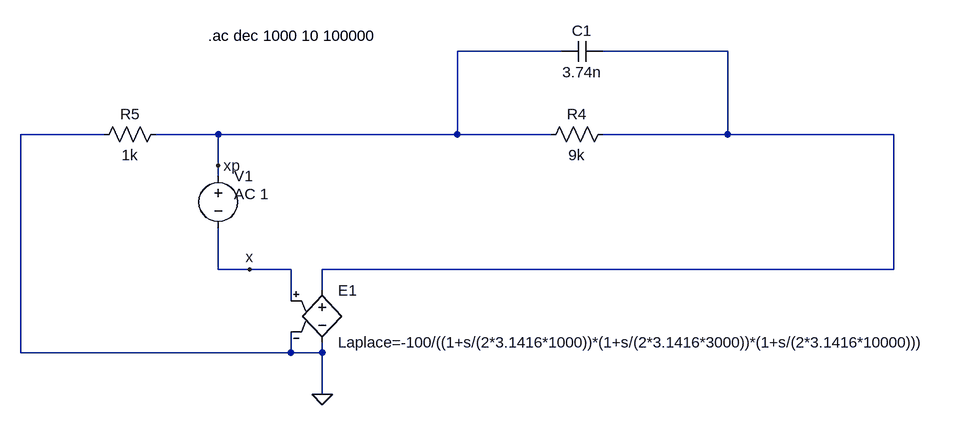
[diagram p0: schematic ganacia de lazo2.asc]
ganacia de lazo2.asc, the LTspice schematic file:
Version 4
SHEET 1 924 680
WIRE -208 -416 -368 -416
WIRE 48 -416 -144 -416
WIRE -912 -288 -1040 -288
WIRE -736 -288 -832 -288
WIRE -368 -288 -368 -416
WIRE -368 -288 -736 -288
WIRE -224 -288 -368 -288
WIRE 48 -288 48 -416
WIRE 48 -288 -144 -288
WIRE 304 -288 48 -288
WIRE -736 -240 -736 -288
WIRE -736 -224 -736 -240
WIRE -736 -80 -736 -144
WIRE -688 -80 -736 -80
WIRE -624 -80 -688 -80
WIRE 304 -80 304 -288
WIRE 304 -80 -576 -80
WIRE -576 -48 -576 -80
WIRE -624 -32 -624 -80
WIRE -1040 48 -1040 -288
WIRE -624 48 -624 16
WIRE -624 48 -1040 48
WIRE -576 48 -576 32
WIRE -576 48 -624 48
WIRE -576 112 -576 48
FLAG -736 -240 xp
FLAG -688 -80 x
FLAG -576 112 0
SYMBOL e -576 -64 R0
SYMATTR InstName E1
SYMATTR Value Laplace=-100/((1+s/(2*3.1416*1000))*(1+s/(2*3.1416*3000))*(1+s/(2*3.1416*10000)))
SYMBOL res -128 -304 R90
WINDOW 0 0 56 VBottom 2
WINDOW 3 32 56 VTop 2
SYMATTR InstName R4
SYMATTR Value 9k
SYMBOL res -816 -304 R90
WINDOW 0 0 56 VBottom 2
WINDOW 3 32 56 VTop 2
SYMATTR InstName R5
SYMATTR Value 1k
SYMBOL voltage -736 -240 R0
WINDOW 123 24 44 Left 2
WINDOW 39 0 0 Left 2
SYMATTR Value2 AC 1
SYMATTR InstName V1
SYMATTR Value ""
SYMBOL cap -144 -432 R90
WINDOW 0 0 32 VBottom 2
WINDOW 3 32 32 VTop 2
SYMATTR InstName C1
SYMATTR Value 3.74n
TEXT -752 -440 Left 2 !.ac dec 1000 10 100000

The netlist it stands for:
* ganacia de lazo2.asc
E1 N001 0 x 0 Laplace=-100/((1+s/(2*3.1416*1000))*(1+s/(2*3.1416*3000))*(1+s/(2*3.1416*10000)))
R4 N001 xp 9k
R5 xp 0 1k
V1 xp x AC 1
C1 N001 xp 3.74n
.ac dec 1000 10 100000
.backanno
.end